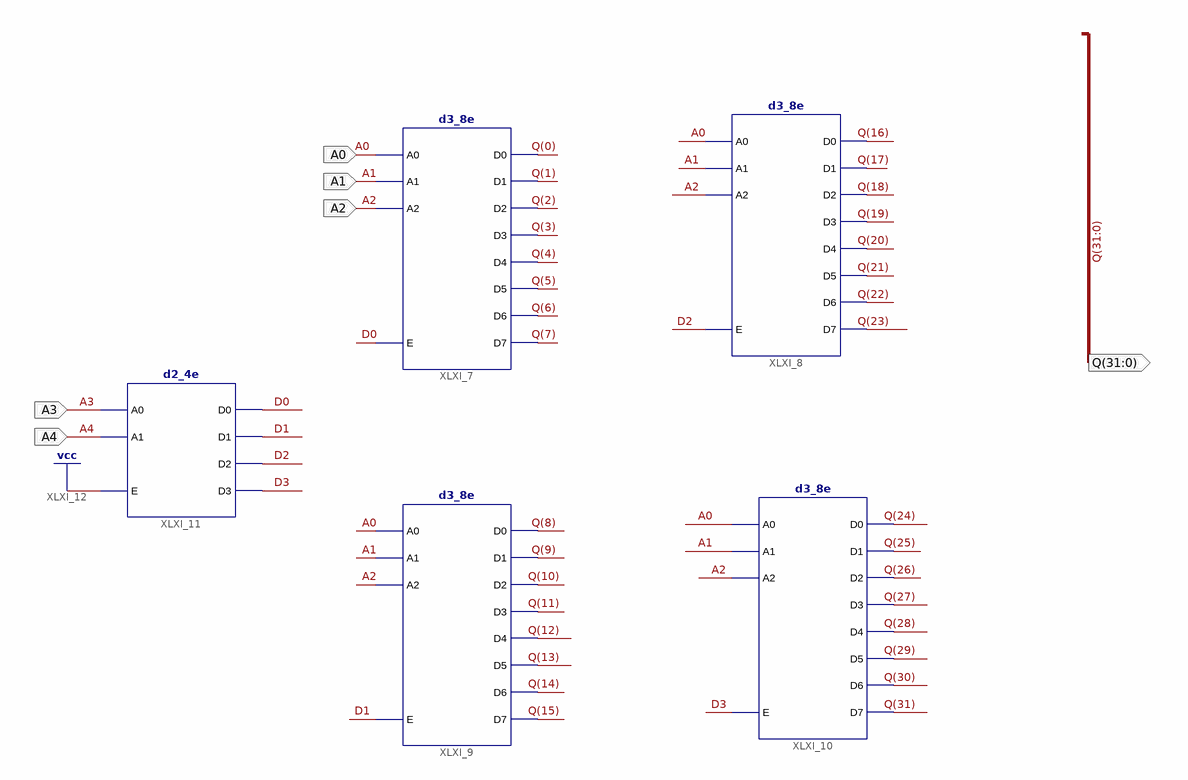
[diagram p0: schematic sheet 1]
// Xilinx ISE schematic decode5_32.sch (artix7) as structural Verilog: 5 symbols, 6 ports
module decode5_32 (
  input  A0,
  input  A1,
  input  A2,
  input  A3,
  input  A4,
  output [31:0] Q
);

  wire D0, D1, D2, D3;

  d3_8e XLXI_7 (
    .A0(A0), .A1(A1), .A2(A2), .E(D0), .D0(Q[0]), .D1(Q[1]), .D2(Q[2]), .D3(Q[3]), .D4(Q[4]), .D5(Q[5]),
    .D6(Q[6]), .D7(Q[7]));
  d3_8e XLXI_8 (
    .A0(A0), .A1(A1), .A2(A2), .E(D2), .D0(Q[16]), .D1(Q[17]), .D2(Q[18]), .D3(Q[19]), .D4(Q[20]),
    .D5(Q[21]), .D6(Q[22]), .D7(Q[23]));
  d3_8e XLXI_9 (
    .A0(A0), .A1(A1), .A2(A2), .E(D1), .D0(Q[8]), .D1(Q[9]), .D2(Q[10]), .D3(Q[11]), .D4(Q[12]), .D5(Q[13]),
    .D6(Q[14]), .D7(Q[15]));
  d3_8e XLXI_10 (
    .A0(A0), .A1(A1), .A2(A2), .E(D3), .D0(Q[24]), .D1(Q[25]), .D2(Q[26]), .D3(Q[27]), .D4(Q[28]),
    .D5(Q[29]), .D6(Q[30]), .D7(Q[31]));
  d2_4e XLXI_11 (.A0(A3), .A1(A4), .E(1'b1), .D0(D0), .D1(D1), .D2(D2), .D3(D3));
endmodule
